# EAGLE schematic sensor (EAGLE 9.2.0)
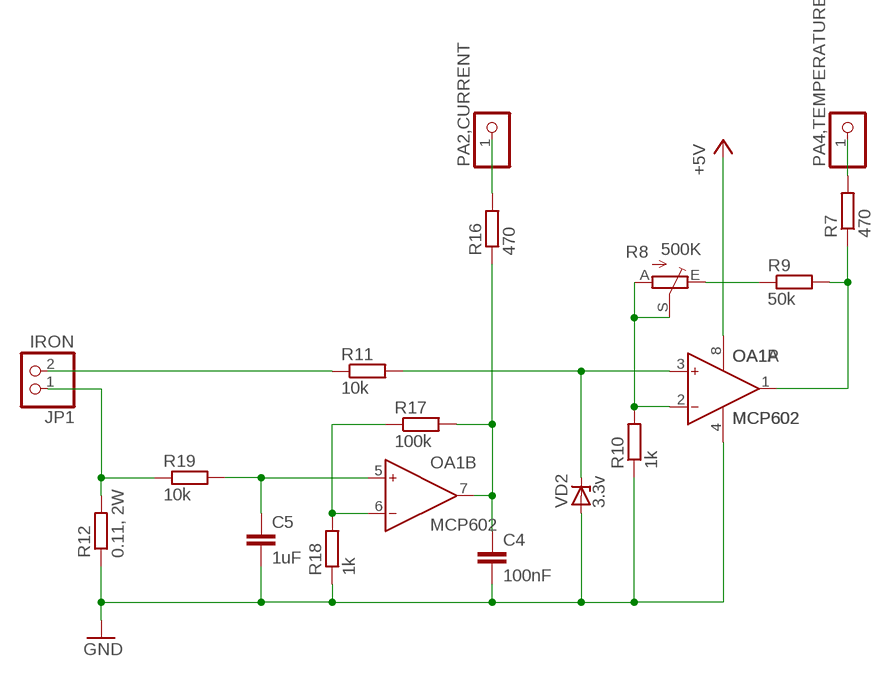
[diagram p0: schematic, sheet 1]

## Parts
C4  100nF  C-EU025-024X044  [C025-024X044]
C5  1uF  C-EU025-024X044  [C025-024X044]
JP1  IRON  PINHD-1X2  [1X02]
OA1  MCP602  AD822N  [DIL08]
PA2,CURRENT  PINHD-1X1  [1X01]
PA4,TEMPERATURE  PINHD-1X1  [1X01]
R7  470  R-EU_0204/5  [0204/5]
R8  500K  TRIM_EU-B64Y  [B64Y]
R9  50k  R-EU_0204/5  [0204/5]
R10  1k  R-EU_0204/5  [0204/5]
R11  10k  R-EU_0204/5  [0204/5]
R12  0.11, 2W  R-EU_0204/5  [0204/5]
R16  470  R-EU_0204/5  [0204/5]
R17  100k  R-EU_0204/5  [0204/5]
R18  1k  R-EU_0204/5  [0204/5]
R19  10k  R-EU_0204/5  [0204/5]
VD2  3.3v  ZENER-DIODEC1702-15  [C1702-15]

## Nets
+5V: OA1.8(P:V+)
GND: C4.2 C5.2 OA1.4(P:V-) R10.1 R12.1 R18.1 VD2.A
N$1: JP1.1 R12.2 R19.1
N$2: C5.1 OA1.5(B:IN+) R19.2
N$3: OA1.6(B:IN-) R17.1 R18.2
N$4: C4.1 OA1.7(B:OUT) R16.1 R17.2
N$5: OA1.3(A:IN+) R11.2 VD2.C
N$6: OA1.2(A:IN-) R8.A R8.S R10.2
N$7: JP1.2 R11.1
N$8: PA2,CURRENT.1 R16.2
N$9: PA4,TEMPERATURE.1 R7.2
N$10: R8.E R9.1
N$11: OA1.1(A:OUT) R7.1 R9.2

## Library data of the parts
C4 C5 = rcl:C-EU: CAPACITOR, European symbol; SPICEPREFIX: C
JP1 = pinhead:PINHD-1X2: PIN HEADER
OA1 = analog-devices:AD822: Single-Supply, Rail-to-Rail Low Power FET-Input Op Amp Source: http://www.analog.com/static/imported-files/data_sheets/AD822.pdf; OC_FARNELL: 1438581; OC_NEWARK: unknown
PA2,CURRENT PA4,TEMPERATURE = pinhead:PINHD-1X1: PIN HEADER
R7 R9-R12 R16-R19 = rcl:R-EU_: RESISTOR, European symbol; SPICEPREFIX: R
R8 = pot:TRIM_EU-: POTENTIOMETER
VD2 = diode:ZENER-DIODE: Z-Diode